# Altium schematic sheet Pulse.SchDoc: TOP SHEET
size A3; Date: 30 08 2013; Author: Rachid AKKOUCHE; CompanyName: RASoftware; DrawnBy: Rachid AKKOUCHE; Engineer: Rachid AKKOUCHE; Organization: SYMOTRONIC; Address1: 52 J03 rue de la crèche; Address2: 77100 MEAUX; Address3: FRANCE; DocumentNumber: BRA201308302; SheetNumber: 2; SheetTotal: 6; Telephone: +33651604047; Email: rachid.akkouche@wanadoo.fr; Proprietaire: SYMOTRONIC; Dessinepar: -; Verifiepar: -; Time: 19:00
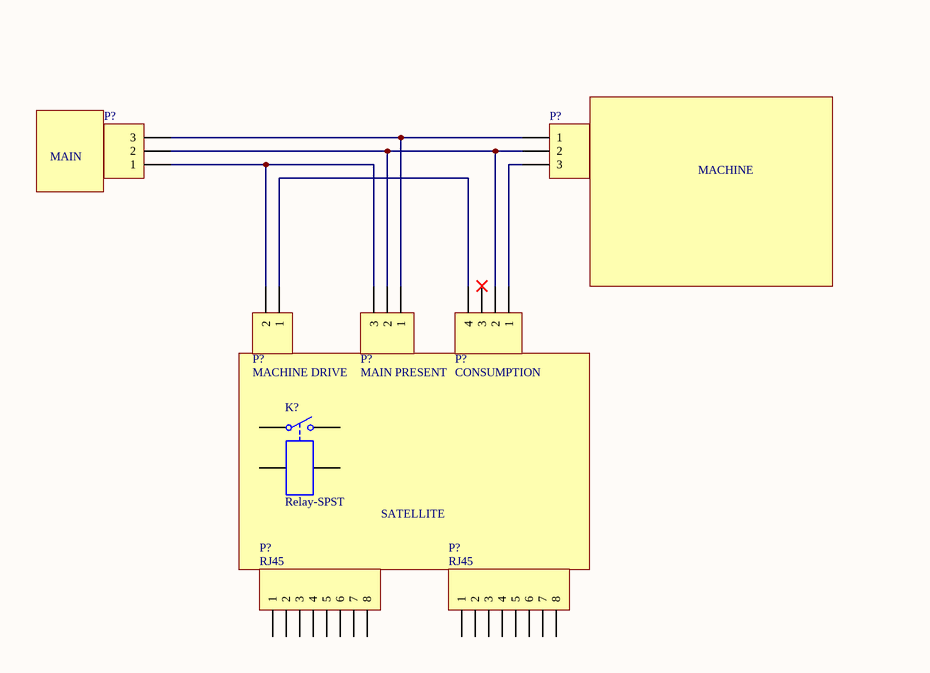
[diagram p0: Pulse.SchDoc, left]
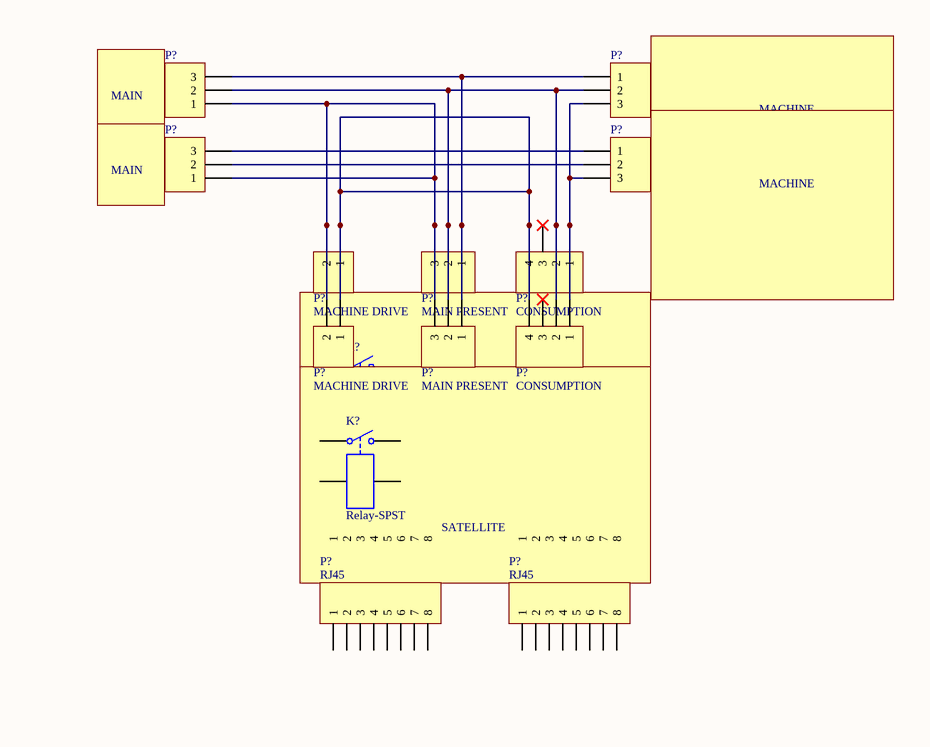
[diagram p1: Pulse.SchDoc, right]

## Parts
(Parts that share a designator on the sheet are numbered #1, #2 ... from top to bottom, then left to right.)
K?#1  Relay-SPST  [MODULE4]
K?#2  Relay-SPST  [MODULE4]
K?#3  Relay-SPST  [MODULE4]
P?#1  Header 3  [HDR1X3]  (value not drawn)
P?#2  Header 3  [HDR1X3]  (value not drawn)
P?#3  Header 3  [HDR1X3]  (value not drawn)
P?#4  Header 3  [HDR1X3]  (value not drawn)
P?#5  MACHINE DRIVE  [CO2P508]
P?#6  MAIN PRESENT  [CO3P508]
P?#7  CONSUMPTION  [CO4P508]
P?#8  MACHINE DRIVE  [CO2P508]
P?#9  MAIN PRESENT  [CO3P508]
P?#10  CONSUMPTION  [CO4P508]
P?#11  Header 3  [HDR1X3]  (value not drawn)
P?#12  Header 3  [HDR1X3]  (value not drawn)
P?#13  MACHINE DRIVE  [CO2P508]
P?#14  MAIN PRESENT  [CO3P508]
P?#15  CONSUMPTION  [CO4P508]
P?#16  RJ45  [Amphenol-RJ45_8]
P?#17  RJ45  [Amphenol-RJ45_8]
P?#18  RJ45  [Amphenol-RJ45_8]
P?#19  RJ45  [Amphenol-RJ45_8]
P?#20  RJ45  [Amphenol-RJ45_8]
P?#21  RJ45  [Amphenol-RJ45_8]

## Blocks framed on the sheet
SATELLITE: K?#1 K?#2 P?#8-P?#10
SATELLITE: P?#16 P?#17
SATELLITE: K?#3

## Nets
NetP?#1_1: P?#1.1 P?#2.3 P?#6.1 P?#9.1
NetP?#1_2: P?#1.2 P?#2.2 P?#6.2 P?#7.2 P?#9.2 P?#10.2
NetP?#1_3: P?#1.3 P?#3.3 P?#7.1 P?#10.1
NetP?#2_1: P?#2.1 P?#4.1 P?#5.2 P?#6.3 P?#8.2 P?#9.3
NetP?#3_1: P?#3.1 P?#4.3
NetP?#3_2: P?#3.2 P?#4.2
NetP?#5_1: P?#5.1 P?#7.4 P?#8.1 P?#10.4
NetP?#11_1: P?#11.1 P?#12.3 P?#14.1
NetP?#11_2: P?#11.2 P?#12.2 P?#14.2 P?#15.2
NetP?#11_3: P?#11.3 P?#15.1
NetP?#12_1: P?#12.1 P?#13.2 P?#14.3
NetP?#13_1: P?#13.1 P?#15.4

Not connected (* = marked no-connect by the designer): K?#1 1 2 3 4; K?#2 1 2 3 4; K?#3 1 2 3 4; P?#7 3*; P?#10 3*; P?#15 3*; P?#16 1 2 3 4 5 6 7 8; P?#17 1 2 3 4 5 6 7 8; P?#18 1 2 3 4 5 6 7 8; P?#19 1 2 3 4 5 6 7 8; P?#20 1 2 3 4 5 6 7 8; P?#21 1 2 3 4 5 6 7 8

## Notes on the sheet
- MAIN
- MACHINE
- Title:
- Project:
- Il ne peut être divulgué sans l'accord écrit de l'un de ses représentants dûment mandaté
- Ce document est la propriété de
- Number:
- Date:
- Draw by:
- Time:
- Revision:
- Sheet
- of
- 52 J03 rue de la crèche
- 77100 Meaux
- Size:
- A3

## Library data of the parts
K?#1-K?#3 = Relay-SPST: Single-Pole Single-Throw Relay; Published: 24-Mar-1999; LatestRevisionDate: 17-Jul-2002; LatestRevisionNote: Re-released for DXP Platform.; PackageReference: MODULE4; Publisher: Altium Limited
P?#1-P?#4 P?#11 P?#12 = Header 3: Header, 3-Pin; LatestRevisionDate: 17-Jul-2002; LatestRevisionNote: Re-released for DXP Platform.; Publisher: Altium Limited
P?#5 P?#8 P?#13 = Header 2: Header, 2-Pin; Manufacturer: TE CONNECTIVITY / BUCHANAN; Manufacturer Part Number: 796636-2; Terminaison du contact: Traversant vertical; Genre: Embase; Nombre de contacts: 2; Nombre de rangées: 1; Pas: 5.08; Plaquage du contact: Etain; Matériau du contact: Bronze phosphoreux<!--FANDB--><div class="features-and-benefits-container"></div>; Supplier 1: Farnell; Supplier Part Number 1: 2059815; RoHS: YES; Pricing 1: 10=0,5, 100=0,39, 500=0,34, 1000=0,27, 2000=0,211, 5000=0,207, 5000=0,203, 30000=0,199 (EUR); Gamme de produit: -; ComponentLink1URL: http://www.farnell.com/cad/1652960.pdf; ComponentLink1Description: http://www.farnell.com/cad/1652960.pdf; ComponentLink2URL: http://www.farnell.com/datasheets/1509424.pdf; ComponentLink2Description: http://www.farnell.com/datasheets/1509424.pdf
P?#6 P?#9 P?#14 = Header 3: Header, 3-Pin; Manufacturer: TE CONNECTIVITY / BUCHANAN; Manufacturer Part Number: 796636-3; Supplier 1: Farnell; Supplier Part Number 1: 2059780; RoHS: YES; Pricing 1: 10=0,68, 100=0,51, 500=0,43, 1000=0,36, 2000=0,35, 5000=0,33 (EUR); ComponentLink1URL: http://www.farnell.com/cad/1652960.pdf; ComponentLink1Description: http://www.farnell.com/cad/1652960.pdf; ComponentLink2URL: http://www.farnell.com/datasheets/1650926.pdf; ComponentLink2Description: http://www.farnell.com/datasheets/1650926.pdf
P?#7 P?#10 P?#15 = Header 4: Header, 4-Pin; Manufacturer: TE CONNECTIVITY / BUCHANAN; Manufacturer Part Number: 796636-4; Supplier 1: Farnell; Supplier Part Number 1: 2059781; RoHS: YES; Stock 1: 207; ComponentLink1URL: http://www.farnell.com/cad/1652960.pdf; ComponentLink1Description: http://www.farnell.com/cad/1652960.pdf; ComponentLink2URL: http://www.farnell.com/datasheets/1650926.pdf; ComponentLink2Description: http://www.farnell.com/datasheets/1650926.pdf
P?#16-P?#21 = Header 8: Header, 8-Pin; Manufacturer: MOLEX; Manufacturer Part Number: 85502-5008; Supplier 1: Farnell; Supplier Part Number 1: 1331561; RoHS: YES; Pricing 1: 1=1,34, 10=0,873, 50=0,797, 100=0,662, 200=0,597, 500=0,541, 500=0,496, 5000=0,493 (EUR); ComponentLink1URL: http://www.farnell.com/cad/1712028.pdf; ComponentLink1Description: http://www.farnell.com/cad/1712028.pdf; ComponentLink2URL: http://www.farnell.com/datasheets/1827260.pdf; ComponentLink2Description: http://www.farnell.com/datasheets/1827260.pdf